# EAGLE board FullBoard (EAGLE 9.3.2)
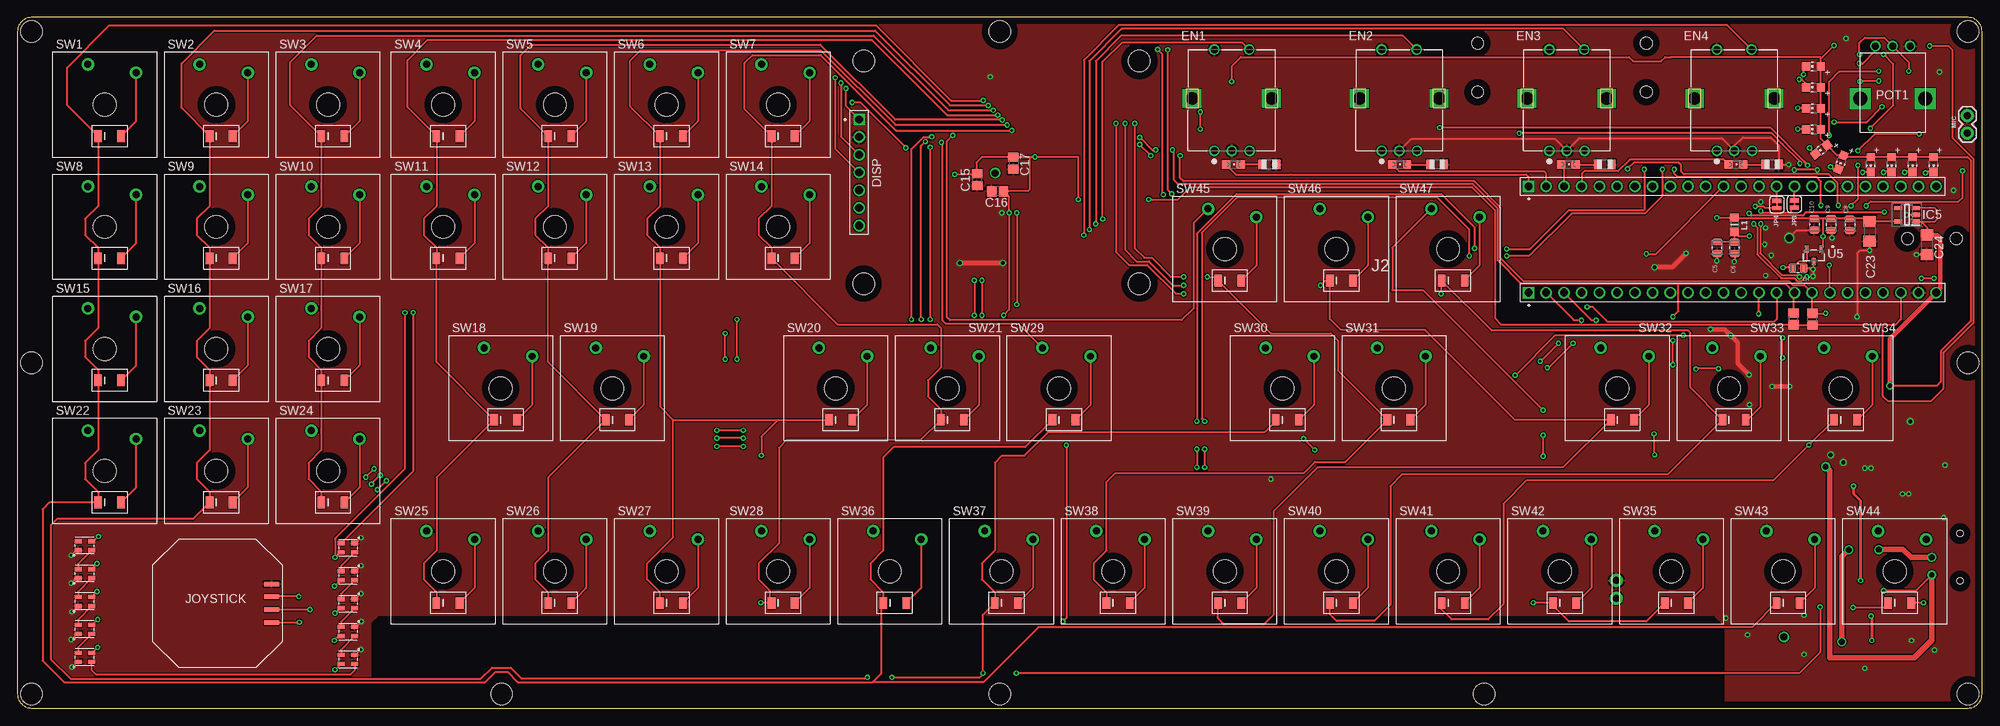
[diagram p3: board, top side]
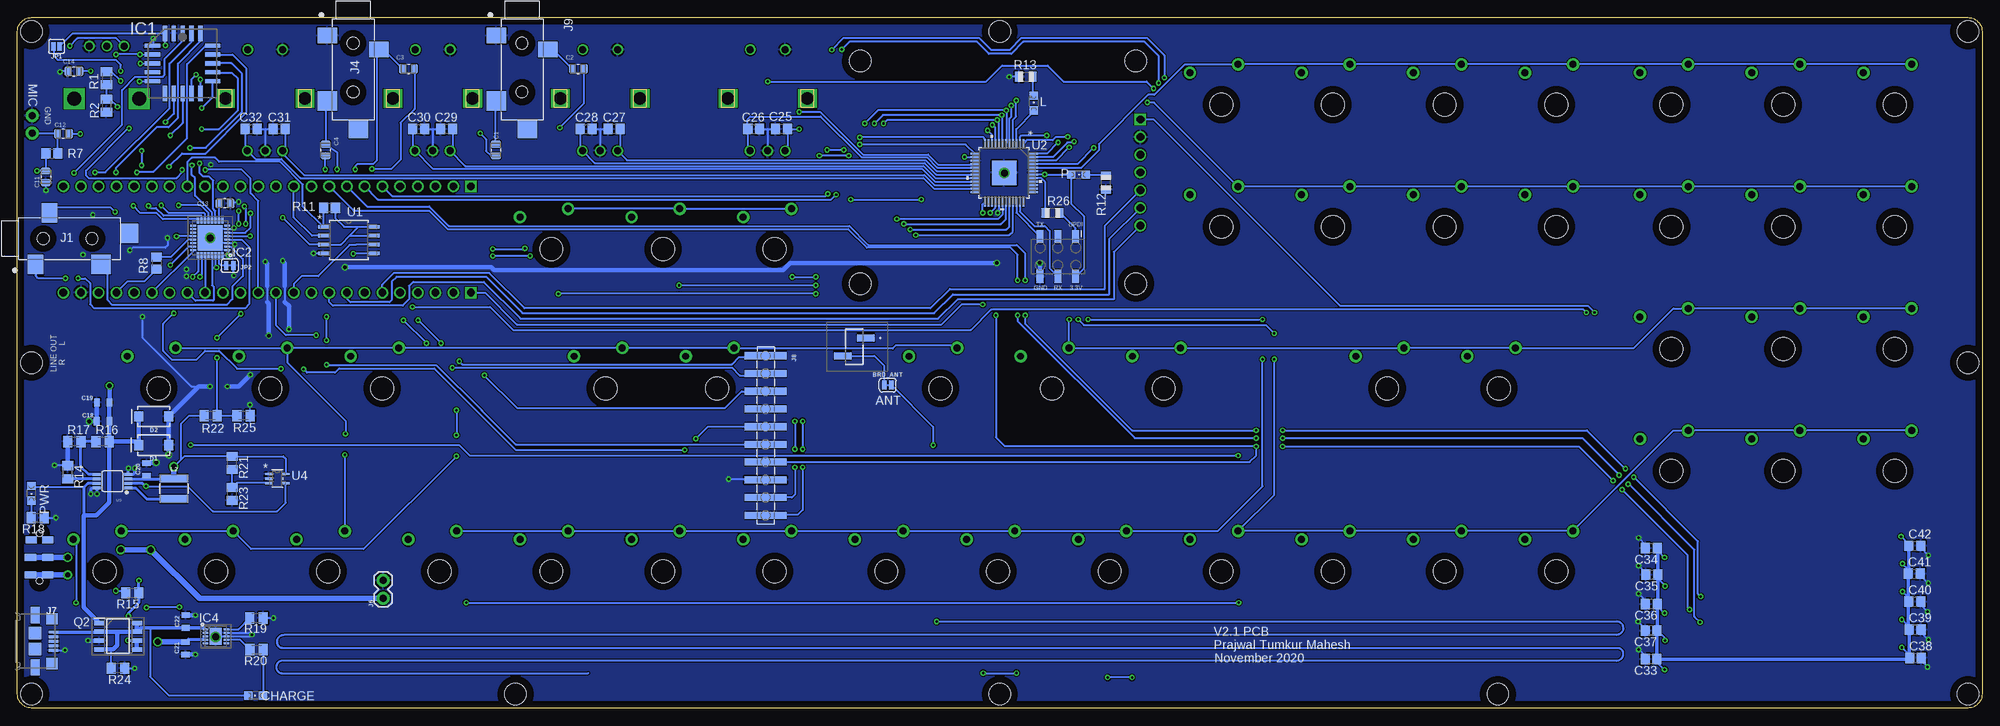
[diagram p4: board, bottom side, seen from below]

Size 281.5 x 99 mm. Coordinates in mm from the lower left corner, seen from the top.
Outline: 0,97 0,2 arc90 2,0 279.5,0 arc90 281.5,2 281.5,97 arc90 279.5,99 2,99 arc90 0,97
Copper layers (1*16): Top 0.035mm / dielectric 1.5mm / Bottom 0.035mm
Design rules "default": minimum track width 6mil, minimum drill 0.35mm, track to track 6mil, track to pad 6mil, pad to pad 6mil, via to via 6mil, smd to smd 6mil, copper to edge 40mil, drill to drill 6mil, minimum pad ring 10mil, minimum via ring 8mil, stop-mask expansion 4mil, vias tented up to drill 0mil, thermal gap 10mil
Holes 3.1 mm at 121.25,92.74 160.75,92.74 160.75,60.83 121.25,60.83 2,97 2,2 279.5,2 279.5,97 140.75,2 140.75,97 2,49.5 279.5,49.5 210.12,2 69.38,2

## Footprints (pad centres in the part's own frame; a part is rotated, then mirrored left to right if it is on the bottom)
M208770246R = smd 1 x 2.51: 1 -1.27,1.655; 2 1.27,-1.655
SMT-JUMPER_2_NC_TRACE_SILK = smd 0.635 x 1.27: 1 -0.508,0; 2 0.508,0
CAP_0805 = smd 1.05 x 1.38: 1 -0.84,0; 2 0.84,0
C0805 = smd 1.3 x 1.5: 1 -0.85,0; 2 0.85,0
0805 = smd 0.8 x 1.2: 1 -0.9,0; 2 0.9,0
C1206 = smd 1.6 x 1.8: 1 -1.4,0; 2 1.4,0
CHIPLED_0805 = smd 1.2 x 1.2: A 0,-1.05; C 0,1.05
SMA-DIODE = smd 1.27 x 1.47: A -2.15,0; C 2.15,0
61300711121 = drill 1.1 square: 1 -7.62,0 | drill 1.1: 2 -5.08,0; 3 -2.54,0; 4 0,0; 5 2.54,0; 6 5.08,0; 7 7.62,0
PEC11R-4215K-S0024 = drill 1: 1 -2.5,7; 2 2.5,7; A -2.5,-7.5; B 2.55,-7.5; C 0,-7.5 | drill 1.8 square: M1 -5.7,0; M2 5.7,0
PLCC20S = smd 0.6 x 2.2: 1 0,4.3; 2 -1.27,4.3; 3 -2.54,4.3; 9 -2.54,-4.3; 10 -1.27,-4.3; 11 0,-4.3; 12 1.27,-4.3; 13 2.54,-4.3; 19 2.54,4.3; 20 1.27,4.3 | smd 2.2 x 0.6: 4 -4.3,2.54; 5 -4.3,1.27; 6 -4.3,0; 7 -4.3,-1.27; 8 -4.3,-2.54; 14 4.3,-2.54; 15 4.3,-1.27; 16 4.3,0; 17 4.3,1.27; 18 4.3,2.54
QFN50P500X500X90-33N = smd 0.85 x 0.3: 1 -2.45,1.75; 2 -2.45,1.25; 3 -2.45,0.75; 4 -2.45,0.25; 5 -2.45,-0.25; 6 -2.45,-0.75; 7 -2.45,-1.25; 8 -2.45,-1.75; 17 2.45,-1.75; 18 2.45,-1.25; 19 2.45,-0.75; 20 2.45,-0.25; 21 2.45,0.25; 22 2.45,0.75; 23 2.45,1.25; 24 2.45,1.75 | smd 0.3 x 0.85: 9 -1.75,-2.45; 10 -1.25,-2.45; 11 -0.75,-2.45; 12 -0.25,-2.45; 13 0.25,-2.45; 14 0.75,-2.45; 15 1.25,-2.45; 16 1.75,-2.45; 25 1.75,2.45; 26 1.25,2.45; 27 0.75,2.45; 28 0.25,2.45; 29 -0.25,2.45; 30 -0.75,2.45; 31 -1.25,2.45; 32 -1.75,2.45 | smd 3.6 x 3.6: 33 0,0
SON50P300X300X100-11N = smd 0.8 x 0.3: 1 -1.5,1; 2 -1.5,0.5; 3 -1.5,0; 4 -1.5,-0.5; 5 -1.5,-1; 6 1.5,-1; 7 1.5,-0.5; 8 1.5,0; 9 1.5,0.5; 10 1.5,1 | smd 1.75 x 2.45: 11 0,0
SOT95P280X145-5N = smd 1.15 x 0.6: 1 -1.25,0.95; 2 -1.25,0; 3 -1.25,-0.95; 4 1.25,-0.95; 5 1.25,0.95
SJ-3524-SMT-TR = smd 2.2 x 2.8: 1 -3.6,-3.7; 3 -1.6,3.7 | smd 2.8 x 2.8: 2 5.8,-3.7 | smd 2.6 x 2.8: 4 9.8,0.75 | hole 1.7: -2.5,0; 4.5,0
61302411121 = drill 1.1 square: 1 -29.21,0 | drill 1.1: 2 -26.67,0; 3 -24.13,0; 4 -21.59,0; 5 -19.05,0; 6 -16.51,0; 7 -13.97,0; 8 -11.43,0; 9 -8.89,0; 10 -6.35,0; 11 -3.81,0; 12 -1.27,0; 13 1.27,0; 14 3.81,0; 15 6.35,0; 16 8.89,0; 17 11.43,0; 18 13.97,0; 19 16.51,0; 20 19.05,0; 21 21.59,0; 22 24.13,0; 23 26.67,0; 24 29.21,0
2X3_SMD = smd 1.02 x 1.9: 1 -2.54,-2.85; 2 -2.54,2.85; 3 0,-2.85; 4 0,2.85; 5 2.54,-2.85; 6 2.54,2.85
1X02 = drill 1.016 pad 1.88: 1 0,0; 2 2.54,0
1981584-1 = smd 0.4 x 1.35: 1 -1.3,4.1; 2 -0.65,4.1; 3 0,4.1; 4 0.65,4.1; 5 1.3,4.1 | smd 1.8 x 1.8: M1 -1.15,1.45; M2 1.15,1.45 | smd 2.3 x 1.3: S1 -3.75,1.45; S2 3.75,1.45 | smd 1.6 x 1.6: S3 -3.2,3.885; S4 3.2,3.885
1X10_SMD_MALE = smd 1.02 x 6: 1 0,0; 2 2.54,0; 3 5.08,0; 4 7.62,0; 5 10.16,0; 6 12.7,0; 7 15.24,0; 8 17.78,0; 9 20.32,0; 10 22.86,0
SMT-JUMPER_2_NO_SILK = smd 0.635 x 1.27: 1 -0.406,0; 2 0.406,0
RC-MASTER-SMD_L0805MP = smd 1.2 x 1.3: 1 -1.016,0; 2 1.016,0
INDUCTOR_4X4MM = smd 4.089 x 1.143: P$1 0,1.473; P$2 0,-1.473
CHIP-LED0805 = smd 1.2 x 1.2: A 0,-1.05; C 0,1.05
PO915N_POT = drill 1: ADJ 0,-7.5; V1 -2.5,-7.5; V2 2.5,-7.5 | drill 2 square: P$4 -4.65,0; P$5 4.65,0
SOIC127P600X175-8N = smd 1.5 x 0.65: 1 -2.7,1.905; 2 -2.7,0.635; 3 -2.7,-0.635; 4 -2.7,-1.905; 5 2.7,-1.905; 6 2.7,-0.635; 7 2.7,0.635; 8 2.7,1.905
M0805 = smd 1.3 x 1.6: 1 -0.95,0; 2 0.95,0
R0805 = smd 1.1 x 1.4: 1 -1,0; 2 1,0
R0805' = smd 1.3 x 1.5: 1 -0.85,0; 2 0.85,0
GATERON_LP_PLAIN = drill 1 pad 1.778: 1 -2.4,5.8; SW2 4.5,4.6 | smd 1.1 x 1.65: 2 -0.95,-4.5; A 2.35,-4.5 | hole 3.3: 0,0
WIN_S-8_WIN = smd 1.499 x 0.533: 1 -3.658,1.905; 2 -3.658,0.635; 3 -3.658,-0.635; 4 -3.658,-1.905; 5 3.658,-1.905; 6 3.658,-0.635; 7 3.658,0.635; 8 3.658,1.905
TQFP48_7X7MC_MCH = smd 1.341 x 0.279: 1 -4.176,2.75; 2 -4.176,2.25; 3 -4.176,1.75; 4 -4.176,1.25; 5 -4.176,0.75; 6 -4.176,0.25; 7 -4.176,-0.25; 8 -4.176,-0.75; 9 -4.176,-1.25; 10 -4.176,-1.75; 11 -4.176,-2.25; 12 -4.176,-2.75; 25 4.176,-2.75; 26 4.176,-2.25; 27 4.176,-1.75; 28 4.176,-1.25; 29 4.176,-0.75; 30 4.176,-0.25; 31 4.176,0.25; 32 4.176,0.75; 33 4.176,1.25; 34 4.176,1.75; 35 4.176,2.25; 36 4.176,2.75 | smd 0.279 x 1.341: 13 -2.75,-4.176; 14 -2.25,-4.176; 15 -1.75,-4.176; 16 -1.25,-4.176; 17 -0.75,-4.176; 18 -0.25,-4.176; 19 0.25,-4.176; 20 0.75,-4.176; 21 1.25,-4.176; 22 1.75,-4.176; 23 2.25,-4.176; 24 2.75,-4.176; 37 2.75,4.176; 38 2.25,4.176; 39 1.75,4.176; 40 1.25,4.176; 41 0.75,4.176; 42 0.25,4.176; 43 -0.25,4.176; 44 -0.75,4.176; 45 -1.25,4.176; 46 -1.75,4.176; 47 -2.25,4.176; 48 -2.75,4.176 | smd 3.505 x 3.505: EPAD 0,0
MSOP8 = smd 0.4 x 1.1: 1 -0.975,-2.25; 2 -0.325,-2.25; 3 0.325,-2.25; 4 0.975,-2.25; 5 0.975,2.25; 6 0.325,2.25; 7 -0.325,2.25; 8 -0.975,2.25
21-0076E_MXM-M = smd 1.079 x 0.305: 1 -1.213,0.65; 2 -1.213,0; 3 -1.213,-0.65; 4 1.213,-0.65; 5 1.213,0.65
SOT-23_DIO-L = smd 0.53 x 1.01: 1 -1.025,-0.895; 2 1.025,-0.895; 3 0,0.895
JS202011JAQN = smd 1 x 1.6: P$1 0,0; P$2 2.5,0; P$3 5,0; P$4 0,-2.4; P$5 2.5,-2.5; P$6 5,-2.5 | hole 0.9: -0.9,-1.2; 5.9,-1.2
PSP_JOYSTICK = smd 2.159 x 0.635: GND 7.75,2.75; POWER 7.75,-0.917; X 7.75,-2.75; Y 7.75,0.917
SK6805-2427 = smd 1 x 0.6: DIN 0.375,1.85; DOUT 2.325,0.55; GND 2.325,1.85; VCC 0.375,0.55

## Placement (x,y rotation side)
ANT  M20-8770246R  [M208770246R]  161.6,51.77 270 bottom
BRD_ANT  JUMPER-SMT_2_NC_TRACE_SILK  [SMT-JUMPER_2_NC_TRACE_SILK]  156.8,46.3 0 bottom
C1  2.2uF  [CAP_0805]  212.95,80 270 bottom
C2  2.2uF  [CAP_0805]  201.16,91.65 0 bottom
C3  2.2uF  [CAP_0805]  225.46,91.65 0 bottom
C4  2.2uF  [CAP_0805]  237.35,80 270 bottom
C5  0.1uF  [CAP_0805]  243.55,66 90 top
C6  2.2uF  [CAP_0805]  246.05,65.98 90 top
C7  2.2uF  [CAP_0805]  255.14,63.05 180 top
C8  0.1uF  [CAP_0805]  262.57,69.3 270 top
C9  0.1uF  [CAP_0805]  259.87,69.32 270 top
C10  2.2uF  [CAP_0805]  257.47,69.34 270 top
C11  2,2uF  [CAP_0805]  277.43,76.16 270 bottom
C12  0.1uF  [CAP_0805]  274.92,82.33 180 bottom
C13  0.15uF  [CAP_0805]  251.8,72.33 180 bottom
C14  0.1uF  [CAP_0805]  273.42,91.27 0 bottom
C15  100nF  [C0805]  137.51,75.77 270 top
C16  100nF  [C0805]  140.45,74.09 180 top
C17  100nF  [C0805]  142.71,78.13 270 top
C18  22uF  [0805]  269.24,41.11 180 bottom
C19  22uF  [0805]  269.23,43.81 180 bottom
C20  22uF  [0805]  262.99,34.22 90 bottom
C21  22uF  [0805]  257.41,8.59 270 bottom
C22  22uF  [0805]  257.39,12.4 90 bottom
C23  1uF  [C1206]  265.39,68.35 270 top
C24  1uF  [C1206]  273.59,66.43 270 top
C25  100nF  [C0805]  172,83 180 bottom
C26  100nF  [C0805]  176,83 0 bottom
C27  100nF  [C0805]  196,83 180 bottom
C28  100nF  [C0805]  200,83 0 bottom
C29  100nF  [C0805]  220,83 180 bottom
C30  100nF  [C0805]  224,83 0 bottom
C31  100nF  [C0805]  244,83 180 bottom
C32  100nF  [C0805]  248,83 0 bottom
C33  .1uF  [C0805]  47.42,7 180 bottom
C34  .1uF  [C0805]  47.37,22.9 180 bottom
C35  .1uF  [C0805]  47.32,19.1 180 bottom
C36  .1uF  [C0805]  47.37,14.9 180 bottom
C37  .1uF  [C0805]  47.42,11.1 180 bottom
C38  .1uF  [C0805]  9.53,7.2 0 bottom
C39  .1uF  [C0805]  9.6,11.25 0 bottom
C40  .1uF  [C0805]  9.65,15.25 0 bottom
C41  .1uF  [C0805]  9.7,19.25 0 bottom
C42  .1uF  [C0805]  9.65,23.25 0 bottom
CHARGE  [CHIPLED_0805]  247.36,1.81 90 bottom
D1  3A/40V/500mV  [SMA-DIODE]  261.99,37.69 180 bottom
D2  3A/40V/500mV  [SMA-DIODE]  261.97,41.79 180 bottom
DISP  61300711121  [61300711121]  120.6,76.78 270 top
EN1  PEC11R-4215K-S0024  [PEC11R-4215K-S0024]  174,87.38 0 top
EN2  PEC11R-4215K-S0024  [PEC11R-4215K-S0024]  198,87.38 0 top
EN3  PEC11R-4215K-S0024  [PEC11R-4215K-S0024]  222,87.38 0 top
EN4  PEC11R-4215K-S0024  [PEC11R-4215K-S0024]  246,87.38 0 top
IC1  LM3914V  [PLCC20S]  257.83,92.41 0 bottom
IC2  SGTL5000XNAA3  [QFN50P500X500X90-33N]  253.88,67.4 180 bottom
IC4  MCP73113-16SI_MF  [SON50P300X300X100-11N]  253.08,10.29 0 bottom
IC5  NCP163ASN330T1G  [SOT95P280X145-5N]  270.73,70.71 180 top
J1  SJ-3524-SMT-TR  [SJ-3524-SMT-TR]  275.3,67.3 0 bottom
J2  Teensy2  [61302411121]  245.73,59.55 0 top
J3  Teensy1  [61302411121]  245.73,74.79 0 top
J4  SJ-3524-SMT-TR  [SJ-3524-SMT-TR]  233.4,92.8 270 bottom
J5  [2X3_SMD]  132.42,64.73 180 bottom
J6  [1X02]  229.09,15.75 90 bottom
J7  1981584-1  [1981584-1]  280.43,9.58 270 bottom
J8  [1X10_SMD_MALE]  174.3,50.5 270 bottom
J9  SJ-3524-SMT-TR  [SJ-3524-SMT-TR]  209.2,92.8 270 bottom
JP1  JUMPER-SMT_2_NO_SILK  [SMT-JUMPER_2_NO_SILK]  275.9,94.83 180 bottom
JP2  JUMPER-SMT_2_NC_TRACE_SILK  [SMT-JUMPER_2_NC_TRACE_SILK]  251.08,63.41 180 bottom
JP3  JUMPER-SMT_2_NC_TRACE_SILK  [SMT-JUMPER_2_NC_TRACE_SILK]  254.59,72.25 270 top
JP4  JUMPER-SMT_2_NC_TRACE_SILK  [SMT-JUMPER_2_NC_TRACE_SILK]  252.09,72.18 270 top
L  [CHIPLED_0805]  135.88,86.74 0 bottom
L1  [RC-MASTER-SMD_L0805MP]  246.01,69.3 270 top
L2  2.2UH3A  [INDUCTOR_4X4MM]  259.08,31.46 0 bottom
LED1  [CHIP-LED0805]  274.56,77.92 180 top
LED2  [CHIP-LED0805]  271.56,77.92 180 top
LED3  [CHIP-LED0805]  268.56,77.92 180 top
LED4  [CHIP-LED0805]  265.56,77.92 180 top
LED5  [CHIP-LED0805]  261.29,78.23 159.7 top
LED6  [CHIP-LED0805]  258.46,80.05 127.4 top
LED7  [CHIP-LED0805]  257.34,82.97 90 top
LED8  [CHIP-LED0805]  257.34,85.97 90 top
LED9  [CHIP-LED0805]  257.34,88.97 90 top
LED10  [CHIP-LED0805]  257.34,91.97 90 top
LED11  [CHIPLED_0805]  174.23,77.92 270 top
LED12  [CHIPLED_0805]  198.03,77.92 270 top
LED13  [CHIPLED_0805]  222.23,77.92 270 top
LED14  [CHIPLED_0805]  246.23,77.92 270 top
MIC  [1X02]  279.4,82.4 90 top
P  [CHIPLED_0805]  129.46,76.46 270 bottom
POT1  P0915N_POT  [PO915N_POT]  268.71,87.38 180 top
PWR  [CHIPLED_0805]  279.5,30.8 180 bottom
Q2  DMG9926USD-13  [SOIC127P600X175-8N]  267.08,10.31 0 bottom
R1  2.2K  [M0805]  268.75,90.3 90 bottom
R2  3.3K  [M0805]  268.75,86.35 90 bottom
R3  220  [R0805]  179.4,77.92 180 top
R4  220  [R0805]  203.42,77.92 180 top
R5  220  [R0805]  227.44,77.92 180 top
R6  220  [R0805]  251.4,77.92 180 top
R7  2.2k  [R0805']  276.56,79.5 0 bottom
R8  100  [R0805']  261.55,63.8 270 bottom
R9  2.2k  [R0805']  254.5,55.79 90 top
R10  2.2k  [R0805']  257.2,55.74 90 top
R11  10k  [R0805']  236.79,71.7 180 bottom
R12  10k  [R0805]  125.52,75.32 90 bottom
R13  10k  [R0805]  137,90.52 0 bottom
R14  DNP  [M0805]  274.31,33.8 270 bottom
R15  750K  [M0805]  265.05,16.51 180 bottom
R16  750K  [M0805]  269.3,38.19 0 bottom
R17  100K  [M0805]  273.35,38.19 0 bottom
R18  4.7K  [M0805]  278.59,27.29 180 bottom
R19  1.15K  [M0805]  247.25,12.91 180 bottom
R20  440  [M0805]  247.24,8.39 180 bottom
R21  3.2M  [M0805]  250.71,35.15 270 bottom
R22  4K  [M0805]  253.8,41.9 0 bottom
R23  1.82M  [M0805]  250.71,30.7 270 bottom
R24  100K  [M0805]  267.1,5.69 0 bottom
R25  10K  [M0805]  249.1,41.9 0 bottom
R26  4.7K  [R0805]  133.2,71 0 bottom
SW1  GATERON_LOW_PROFILE  [GATERON_LP_PLAIN]  12.5,86.48 0 top
SW2  GATERON_LOW_PROFILE  [GATERON_LP_PLAIN]  28.5,86.48 0 top
SW3  GATERON_LOW_PROFILE  [GATERON_LP_PLAIN]  44.5,86.48 0 top
SW4  GATERON_LOW_PROFILE  [GATERON_LP_PLAIN]  61,86.48 0 top
SW5  GATERON_LOW_PROFILE  [GATERON_LP_PLAIN]  77,86.48 0 top
SW6  GATERON_LOW_PROFILE  [GATERON_LP_PLAIN]  93,86.48 0 top
SW7  GATERON_LOW_PROFILE  [GATERON_LP_PLAIN]  109,86.48 0 top
SW8  GATERON_LOW_PROFILE  [GATERON_LP_PLAIN]  12.5,68.98 0 top
SW9  GATERON_LOW_PROFILE  [GATERON_LP_PLAIN]  28.5,68.98 0 top
SW10  GATERON_LOW_PROFILE  [GATERON_LP_PLAIN]  44.5,68.98 0 top
SW11  GATERON_LOW_PROFILE  [GATERON_LP_PLAIN]  61,68.98 0 top
SW12  GATERON_LOW_PROFILE  [GATERON_LP_PLAIN]  77,68.98 0 top
SW13  GATERON_LOW_PROFILE  [GATERON_LP_PLAIN]  93,68.98 0 top
SW14  GATERON_LOW_PROFILE  [GATERON_LP_PLAIN]  109,68.98 0 top
SW15  GATERON_LOW_PROFILE  [GATERON_LP_PLAIN]  12.5,51.48 0 top
SW16  GATERON_LOW_PROFILE  [GATERON_LP_PLAIN]  28.5,51.48 0 top
SW17  GATERON_LOW_PROFILE  [GATERON_LP_PLAIN]  44.5,51.48 0 top
SW18  GATERON_LOW_PROFILE  [GATERON_LP_PLAIN]  69.25,45.83 0 top
SW19  GATERON_LOW_PROFILE  [GATERON_LP_PLAIN]  85.25,45.83 0 top
SW20  GATERON_LOW_PROFILE  [GATERON_LP_PLAIN]  117.25,45.83 0 top
SW21  GATERON_LOW_PROFILE  [GATERON_LP_PLAIN]  133.25,45.83 0 top
SW22  GATERON_LOW_PROFILE  [GATERON_LP_PLAIN]  12.5,33.98 0 top
SW23  GATERON_LOW_PROFILE  [GATERON_LP_PLAIN]  28.5,33.98 0 top
SW24  GATERON_LOW_PROFILE  [GATERON_LP_PLAIN]  44.5,33.98 0 top
SW25  GATERON_LOW_PROFILE  [GATERON_LP_PLAIN]  61,19.58 0 top
SW26  GATERON_LOW_PROFILE  [GATERON_LP_PLAIN]  77,19.58 0 top
SW27  GATERON_LOW_PROFILE  [GATERON_LP_PLAIN]  93,19.58 0 top
SW28  GATERON_LOW_PROFILE  [GATERON_LP_PLAIN]  109,19.58 0 top
SW29  GATERON_LOW_PROFILE  [GATERON_LP_PLAIN]  149.25,45.83 0 top
SW30  GATERON_LOW_PROFILE  [GATERON_LP_PLAIN]  181.25,45.83 0 top
SW31  GATERON_LOW_PROFILE  [GATERON_LP_PLAIN]  197.25,45.83 0 top
SW32  GATERON_LOW_PROFILE  [GATERON_LP_PLAIN]  229.25,45.83 0 top
SW33  GATERON_LOW_PROFILE  [GATERON_LP_PLAIN]  245.25,45.83 0 top
SW34  GATERON_LOW_PROFILE  [GATERON_LP_PLAIN]  261.25,45.83 0 top
SW35  GATERON_LOW_PROFILE  [GATERON_LP_PLAIN]  237,19.58 0 top
SW36  GATERON_LOW_PROFILE  [GATERON_LP_PLAIN]  125,19.58 0 top
SW37  GATERON_LOW_PROFILE  [GATERON_LP_PLAIN]  141,19.58 0 top
SW38  GATERON_LOW_PROFILE  [GATERON_LP_PLAIN]  157,19.58 0 top
SW39  GATERON_LOW_PROFILE  [GATERON_LP_PLAIN]  173,19.58 0 top
SW40  GATERON_LOW_PROFILE  [GATERON_LP_PLAIN]  189,19.58 0 top
SW41  GATERON_LOW_PROFILE  [GATERON_LP_PLAIN]  205,19.58 0 top
SW42  GATERON_LOW_PROFILE  [GATERON_LP_PLAIN]  221,19.58 0 top
SW43  GATERON_LOW_PROFILE  [GATERON_LP_PLAIN]  253,19.58 0 top
SW44  GATERON_LOW_PROFILE  [GATERON_LP_PLAIN]  269,19.58 0 top
SW45  GATERON_LOW_PROFILE  [GATERON_LP_PLAIN]  173,65.78 0 top
SW46  GATERON_LOW_PROFILE  [GATERON_LP_PLAIN]  189,65.78 0 top
SW47  GATERON_LOW_PROFILE  [GATERON_LP_PLAIN]  205,65.78 0 top
U1  W25Q128FVSIG  [WIN_S-8_WIN]  234.03,67.09 0 bottom
U2  ATMEGA4809-AFR  [TQFP48_7X7MC_MCH]  140.13,76.73 270 bottom
U3  PAM2401  [MSOP8]  267.89,32.52 90 bottom
U4  MAX6775XKA+21-0076E_MXM-M  [21-0076E_MXM-M]  244.27,32.89 0 bottom
U5  AP7313-15SAG-7SOT-23_DIO-L  [SOT-23_DIO-L]  257.4,64.9 180 top
U$1  JS202011JAQN  [JS202011JAQN]  277.14,24.12 270 bottom
U$2  PSP_JOYSTICK  [PSP_JOYSTICK]  28.67,15.03 0 top
U$25  NEOPIXEL_NANO_2427  [SK6805-2427]  46,21.78 0 top
U$26  NEOPIXEL_NANO_2427  [SK6805-2427]  46,17.78 0 top
U$27  NEOPIXEL_NANO_2427  [SK6805-2427]  46,13.78 0 top
U$36  NEOPIXEL_NANO_2427  [SK6805-2427]  46,9.78 0 top
U$41  NEOPIXEL_NANO_2427  [SK6805-2427]  46,5.78 0 top
U$42  NEOPIXEL_NANO_2427  [SK6805-2427]  11,8.48 180 top
U$43  NEOPIXEL_NANO_2427  [SK6805-2427]  11,12.48 180 top
U$44  NEOPIXEL_NANO_2427  [SK6805-2427]  11,16.48 180 top
U$45  NEOPIXEL_NANO_2427  [SK6805-2427]  11,20.48 180 top
U$46  NEOPIXEL_NANO_2427  [SK6805-2427]  11,24.48 180 top

## Tracks (layer width: path | path; a pad name or v marks a point on that pad's centre or on a via)
!RADIO_RST  (via drill 0.35)
  Top 0.254: v214.6,47.7 220.34,53.44 v238.7,53.44
  Bottom 0.254: v214.6,47.7 209.94,43.04 180.09,43.04 178.57,44.57 177.73,45.4 174.32,45.4 J8.3 | v238.7,53.44 243.04,53.44 244.46,54.86 J2.12
+5V  (via drill 0.35, 0.65)
  Top 0.254: 258.39,93.09 v260.3,95 | U$43.VCC 10.73,11.93 v11.5,12.7 | v11.4,16.7 v11.39,16.7 U$44.VCC | v11.4,20.7 v11.39,20.7 U$45.VCC | v11.6,24.6 10.93,23.93 U$46.VCC | U$25.VCC 46.23,22.33 v45.5,21.6 45.5,24.3 55.5,34.3 v55.5,56.7 | U$26.VCC 45.54,17.5 v45.4,17.5 | U$27.VCC 46.23,14.33 v45.5,13.6 | U$36.VCC 46.03,10.33 v45.4,9.7 | U$41.VCC 45.54,5.5 v45.5,5.5 | IC5.3 274.74,71.66 275.1,71.3 275.1,70.1 274.7,69.7 272.8,69.7 | DISP.1 118.72,86.29 v118.72,88.81 | v174,89.8 174,92 175.3,93.3 230.9,93.3 231.5,92.7 235.5,92.7 236.1,93.3 236.9,93.3 236.91,93.29 258.39,93.29 258.39,93.09 | 258.39,93.09 LED10.A LED9.A LED8.A LED7.A 258.39,81.6 LED6.A 260.77,79.22 LED5.A 261.89,78.97 LED4.A LED3.A LED2.A LED1.A 279.45,78.97 279.89,78.53 279.89,55.47 275.59,51.17 275.59,46.79 275,46.2 v268.3,46.2 | U$42.VCC arc45 10.81,8.01 v11.5,8.7 | IC5.1 272.04,69.7 272.8,69.7 | 272.8,69.7 273.62,68.88 273.62,67.8
  Top 0.61: v268.3,46.2 268.3,52.92 J2.24 275.54,60.15 275.54,67.36 275.1,67.8 273.62,67.8 C24.1
  Bottom 0.254: JP1.1 273.61,96.71 IC1.3 260.37,95.07 v260.3,95 | v11.5,8.7 10.38,7.58 C38.1 | v11.5,12.7 10.6,11.8 10.6,11.61 arc-45 C39.1 | v11.4,16.7 10.5,15.8 C40.1 10.7,15.25 | v11.4,20.7 10.55,19.85 C41.1 | v11.6,24.6 10.5,23.5 C42.1 | C34.1 46.52,22.62 v45.5,21.6 | C35.1 46.47,18.57 v45.4,17.5 | C36.1 46.52,14.62 v45.5,13.6 | v45.4,9.7 45.4,10 46.5,11.1 C37.1 | C33.1 46.57,6.57 v45.5,5.5 | v118.72,88.81 119.7,89.8 131.6,89.8 133.9,92.1 140.4,92.1 142.7,89.8 v174,89.8 | DISP.1 118.7,84.4 92,57.7 56.5,57.7 v55.5,56.7 | 272,31.6 279.25,31.6 PWR.A
  Bottom 0.406: U3.7 271.4,32.2 272,31.6 272,27.6
  Bottom 0.508: C42.1 10.5,19.3 C41.1 10.55,15.4 10.7,15.25 | C40.1 10.6,15.15 10.6,11.8 | C39.1 10.45,7.27 C38.1 10.58,7 C33.1 C37.1 | C34.1 46.47,22.85 C35.1 46.47,14.95 C36.1 46.52,11.12 46.5,11.1
  Bottom 0.61: Q2.1 272,14.44 272,27.6 270.2,27.6 268.35,29.45 R16.2 | R16.2 268.34,39.7 C18.1 C19.1 268.3,43.84 v268.3,46.2 | D2.C 264.12,37.71 | 264.12,37.71 D1.C | R16.2 264.6,38.19 264.12,37.71
  Bottom 0.813: C19.1
ADDR
  Bottom 0.254: IC2.31 252.63,63.73 252.3,63.4 252.29,63.41 JP2.2
BATT  (via drill 0.4, 0.7 pad 1.3, 0.8 pad 1.3)
  Top 0.254: v267.4,16.8 267.83,16.8 267.84,16.79 271.99,16.79 v274.3,19.1
  Top 0.813: v274.3,19.1 274.3,9.7 271.8,7.2 259.7,7.2 259.7,34 v259.1,34.6
  Bottom 0.254: v267.4,16.8 266.29,16.8 R15.2 | U4.5 243.06,35.76 243.4,36.1 R21.1 257.6,36.1 258.1,35.6 | 258.1,35.6 v259.1,34.6 | R22.1 256.95,41.9 258.1,40.75 258.1,35.6
  Bottom 0.406: 263.46,32.84 C20.1 262.51,32.84 | U3.3 263.46,32.84 | L2.P$1 259.17,32.84 262.51,32.84 | 263.46,32.84 262.51,32.84
  Bottom 0.813: U$1.P$6 U$1.P$3 274.32,19.12 v274.3,19.1 | v259.1,34.6 259.1,32.95 L2.P$1
BATT_DIVIDER  (via drill 0.35)
  Top 0.254: v252.9,50.2 v252.9,53.1 | v249.5,56.5 249.5,59.52 J2.14
  Bottom 0.254: R25.1 R22.2 252.85,50.15 v252.9,50.2 | v252.9,53.1 v249.5,56.5
CODEC_3.3V  (via drill 0.35)
  Top 0.254: IC5.5 C23.1 265,70.14 C8.1 262.55,70.16 C9.1 258.7,70.16 | 258.7,70.16 257.49,70.16 C10.1 246.15,70.18 L1.1 243.52,70.32 v243.5,70.3 | 258.7,70.16 v258.7,67.6 258.7,66.07 U5.1
  Bottom 0.254: v243.5,70.3 239.66,66.45 U1.3 235.15,66.45 233.88,67.72 | 233.88,67.72 U1.7 | 233.88,67.72 232.6,69 U1.8 234.69,69 235.94,70.24 R11.1 | IC2.20 258.65,67.65 v258.7,67.6
COL1  (via drill 0.35)
  Top 0.254: SW29.2 144.37,37.4 125.5,37.4 124.05,35.95 124.05,22.58 122.21,20.74 122.21,18.43 124.05,16.58 124.05,15.2 | 124.05,15.2 SW36.2 | 122.5,3.7 123.8,5 123.8,14.95 124.05,15.2 | 122.5,3.7 71.7,3.7 70.21,5.19 68.49,5.19 67,3.7 6.7,3.7 3.6,6.8 3.6,28.5 4.58,29.48 SW22.2 11.55,30.98 9.71,32.82 9.71,35.14 11.55,36.98 SW15.2 11.55,48.48 9.71,50.32 9.71,52.64 11.55,54.48 SW8.2 11.55,65.98 9.71,67.82 9.71,70.14 11.55,71.98 SW1.2 7.1,86.43 7.1,91.8 13.16,97.86 123.04,97.86 133.8,87.1 v138.4,87.1 | SW43.2 248.57,11.6 178.78,11.6 178.77,11.59 172.73,11.59 172.72,11.6 146.3,11.6 138.4,3.7 122.5,3.7
  Bottom 0.254: U2.4 138.88,84.32 138.4,84.8 v138.4,87.1
COL2  (via drill 0.35)
  Top 0.254: SW30.2 180.3,41.13 178.77,39.6 147.7,39.6 144.3,36.2 141.1,36.2 140.05,35.15 140.05,22.58 138.21,20.74 138.21,18.43 140.05,16.58 SW37.2 138.35,13.38 v138.35,5 138.35,4.85 137.9,4.4 v125.3,4.4 | v121.8,4.4 121.7,4.3 72.2,4.3 70.7,5.8 68,5.8 66.4,4.2 7.6,4.2 4.8,7 4.8,26.2 5.7,27.1 25.17,27.1 SW23.2 27.55,30.98 25.71,32.82 25.71,35.14 27.55,36.98 SW16.2 27.55,48.48 25.71,50.32 25.71,52.64 27.55,54.48 SW9.2 27.55,65.98 25.71,67.82 25.71,70.14 27.55,71.98 SW2.2 23.5,86.03 23.5,92.4 28.2,97.1 122.9,97.1 133.6,86.4 v139.1,86.4 | SW44.2 267.37,14.4 v263,14.4 | v258.3,14.5 258.3,8 255.3,5 v143.1,5
  Bottom 0.254: v121.8,4.4 v125.3,4.4 | U2.5 139.38,84.52 139.1,84.8 v139.1,86.4 | v263,14.4 262.9,14.5 v258.3,14.5 | v143.1,5 v138.35,5
COL3  (via drill 0.35)
  Top 0.254: SW24.2 43.55,30.98 41.71,32.82 41.71,35.14 43.55,36.98 SW17.2 43.55,48.48 41.71,50.32 41.71,52.64 43.55,54.48 SW10.2 43.55,65.98 41.71,67.82 41.71,70.14 43.55,71.98 SW3.2 39.1,86.43 39.1,92.6 42.9,96.4 122.7,96.4 133.4,85.7 v139.8,85.7 | SW38.2 156.05,16.58 154.21,18.43 154.21,20.74 156.05,22.58 156.05,32.4 157.35,33.7 184.3,33.7 185.9,35.3 190.27,35.3 SW31.2 196.27,41.33 189.2,48.4 189.2,52.7 188.2,53.7 179.63,53.7 SW45.2 171.53,61.8 v170.5,61.8 | v167.1,61.8 165.3,61.8 162.55,64.55 161.45,64.55 160.1,65.9 v160.1,83.8
  Bottom 0.254: U2.6 139.8,80.99 v139.8,85.7 158.2,85.7 v160.1,83.8 | v170.5,61.8 v167.1,61.8
COL4  (via drill 0.35)
  Top 0.254: SW25.2 60.05,16.58 58.21,18.43 58.21,20.74 60.05,22.58 60.05,33.08 SW18.2 60.05,49.58 SW11.2 60.05,65.98 58.21,67.82 58.21,70.14 60.05,71.98 SW4.2 55.9,86.13 55.9,92.9 58.8,95.8 122.4,95.8 133.2,85 v140.46,85 | SW39.2 172.05,12.85 172.9,12 178.6,12 180,13.4 180,28.2 186.3,34.5 221.47,34.5 SW32.2 214.57,41.33 201.7,54.2 189.6,54.2 188.05,55.75 SW46.2 187.38,61.28 v186.7,60.6 | v158.7,83.8 158.7,65.7 160.37,64.03 162.13,64.03 165.56,60.6 v167.1,60.6
  Bottom 0.254: U2.7 140.38,84.92 v140.46,85 157.5,85 v158.7,83.8 | v167.1,60.6 v186.7,60.6
COL5  (via drill 0.35)
  Top 0.254: SW26.2 76.05,16.58 74.21,18.43 74.21,20.74 76.05,22.58 76.05,33.08 SW19.2 76.05,49.58 SW12.2 76.05,65.98 74.21,67.82 74.21,70.14 76.05,71.98 SW5.2 72.1,85.93 72.1,93.6 73.59,95.09 115.03,95.09 125.78,84.34 141.06,84.34 v141.1,84.3 | SW40.2 188.05,13.45 189,12.5 194.4,12.5 196.7,14.8 196.7,31.8 198.4,33.5 236.47,33.5 SW33.2 239.7,45.93 239.7,53.8 239.4,54.1 211.23,54.1 SW47.2 204.02,61.32 204,61.3 v204,59.4 | v157.4,83.8 157.4,65.4 159.28,63.52 161.87,63.52 165.99,59.4 v167.1,59.4
  Bottom 0.254: U2.8 140.9,80.92 140.9,84.1 v141.1,84.3 156.9,84.3 v157.4,83.8 | v167.1,59.4 v204,59.4
COL6  (via drill 0.35)
  Top 0.254: 93.97,41.33 109,41.33 | 109,41.33 SW20.2 | 93.97,41.33 92.05,43.25 SW13.2 92.05,65.98 90.21,67.82 90.21,70.14 92.05,71.98 SW6.2 87.8,86.23 87.8,92.8 89.3,94.3 115.1,94.3 125.8,83.6 v141.8,83.6 | SW27.2 92.05,16.58 90.21,18.43 90.21,20.74 93.97,24.5 93.97,41.33 | SW34.2 v256.68,37.72 251.57,32.6 216.2,32.6 212.9,29.3 212.9,14.9 210.7,12.7 205.5,12.7 204.05,14.15 SW41.2 | 109,41.33 106.6,38.93 v106.6,36.2
  Bottom 0.254: U2.9 141.38,83.18 v141.8,83.6 | v256.68,37.72 256.67,37.7 218.2,37.7 216.7,36.2 v106.6,36.2
COL7  (via drill 0.35)
  Top 0.254: v142.5,82.8 125.9,82.8 115.1,93.6 105.3,93.6 104.2,92.5 104.2,85.83 SW7.2 108.05,71.98 106.21,70.14 106.21,67.82 108.05,65.98 SW14.2 117.53,55 131.8,55 132.3,54.5 132.3,48.83 130.46,46.99 130.46,44.67 132.3,42.83 SW21.2 129.37,38.4 110.2,38.4 109.1,37.3 109.1,23.63 106.21,20.74 106.21,18.43 107.77,16.87 107.77,15.37 SW28.2 106.52,15.08 v106.5,15.1 | SW35.2 233.37,12.4 222.3,12.4 220.05,14.65 SW42.2 217.22,15.08 v217.2,15.1
  Bottom 0.254: U2.10 141.88,82.18 v142.5,82.8 | v217.2,15.1 v106.5,15.1
CS1
  Bottom 0.254: DISP.5 125.7,69.14 125.7,60.1 147.9,60.1 150.67,57.33 208.85,57.33 213.9,62.38 213.9,62.4 227.52,62.4 229.22,60.7 J2.6
DC1
  Bottom 0.254: DISP.6 125.09,67.21 125.09,59.29 147.47,59.29 150.14,56.62 209.12,56.62 214.3,61.8 227.2,61.8 227.88,61.12 227.88,58.52 228.2,58.2 233.8,58.2 234.3,58.7 J2.8
EN  (via drill 0.35)
  Top 0.406: v265.6,13.2 265.7,13.1 v265.7,9.7 | v264.1,18.3 264.1,29.7 263.1,30.7 v263.1,31.8
  Bottom 0.254: v263.1,31.8 257.1,31.8 253.5,28.2 244.3,28.2 243.06,29.44 U4.4
  Bottom 0.406: Q2.6 265.68,9.68 v265.7,9.7 | v265.6,13.2 265.6,13.6 264.1,15.1 R15.1 v264.1,18.3 | v263.1,31.8 263.17,31.8 263.57,32.2 U3.2
  Bottom 0.61: Q2.6 Q2.5
ENC1_A  (via drill 0.35)
  Top 0.254: v169.5,83 v169.5,85.46
  Bottom 0.254: EN1.A 171.15,80.23 C25.1 v169.5,83 | v169.5,85.46 166.48,85.46 160.37,79.34 151.02,79.34 149.56,77.89 145.1,77.89 145.09,77.9 144.39,77.9 U2.16
ENC1_B
  Bottom 0.254: EN1.B 176.85,80.18 C26.1 176.85,84.45 176.5,84.8 166.4,84.8 160.54,78.94 151.19,78.94 149.73,77.48 U2.17
ENC1_LED
  Top 0.254: LED11.A 174.6,76.5 182.4,76.5 182.41,76.49 216.2,76.49 216.52,76.18 J3.1
ENC1_SEL  (via drill 0.35)
  Top 0.254: EN1.2 175.44,95.44 158.3,95.44 155.5,92.64 v155.5,70.1
  Bottom 0.254: U2.30 140.38,70.72 141,70.1 v155.5,70.1
ENC2_A
  Bottom 0.254: C27.1 195.15,80.23 EN2.A 194.15,78.53 151.36,78.53 149.81,76.98 U2.18
ENC2_B
  Bottom 0.254: C28.1 200.85,80.18 EN2.B 198.79,78.13 151.53,78.13 149.88,76.48 U2.19
ENC2_LED
  Top 0.254: LED12.A 198,76.9 218.8,76.9 219.06,76.64 J3.2
ENC2_SEL  (via drill 0.35)
  Top 0.254: EN2.2 198.54,96.34 158.1,96.34 154.51,92.76 154.51,69.41 v154.5,69.4
  Bottom 0.254: v154.5,69.4 140.6,69.4 139.88,70.12 U2.31
ENC3_A
  Bottom 0.254: C29.1 219.15,80.23 EN3.A 217.34,77.72 151.69,77.72 149.96,75.98 U2.20
ENC3_B
  Bottom 0.254: C30.1 224.85,80.18 EN3.B 221.98,77.31 151.86,77.31 150.03,75.48 U2.21
ENC3_LED
  Top 0.254: LED13.A 221.6,77.51 J3.3
ENC3_SEL  (via drill 0.35)
  Top 0.254: EN3.2 221.53,97.35 158.2,97.35 153.61,92.76 v153.61,68.61 v153.6,68.6
  Bottom 0.254: v153.6,68.6 139.8,68.6 139.38,69.02 U2.32
ENC4_A
  Bottom 0.254: C31.1 243.15,80.23 EN4.A 243.5,79.48 240.43,76.41 151.53,76.41 150.1,74.98 U2.22
ENC4_B
  Bottom 0.254: C32.1 248.85,80.18 EN4.B 247.38,78.71 243.69,78.71 240.99,76 151.7,76 150.18,74.48 U2.23
ENC4_LED
  Top 0.254: LED14.A 244.48,78.62 231.02,78.62 229.34,76.94 224.5,76.94 224.14,76.58 J3.4
ENC4_SEL  (via drill 0.35)
  Top 0.254: EN4.2 245.02,97.86 157.76,97.86 152.8,92.9 v152.8,67.8
  Bottom 0.254: v152.8,67.8 139.4,67.8 138.88,68.32 U2.33
GND  (via drill 0.35, 0.5, 0.6, 1 pad 1.3)
  Top 0.254: U$42.GND 8.53,6.63 v7.8,5.9 | U$43.GND 8.53,10.63 v7.7,9.8 | U$44.GND 7.84,13.8 v7.8,13.8 | U$45.GND 8.43,18.63 v7.7,17.9 | U$46.GND 8.43,22.63 v7.7,21.9 | U$25.GND 48.43,23.63 v49.2,24.4 | U$26.GND 48.43,19.63 v49.2,20.4 | U$27.GND 48.43,15.63 v49.2,16.4 | U$36.GND 48.53,11.63 v49.3,12.4 | C23.2 v265.4,65.6 264,65.6 263.6,65.2 v263.6,56.1 | C9.2 260,68.35 v260,67.4 | C7.1 257.15,63.05 v257.3,62.9 | U5.3 257.3,63.91 v257.3,62.9 | v257.3,62.9 v257.3,61.9 | C24.2 272.13,65.03 v272.1,65 | IC5.2 v270.7,70.7 | C5.1 243.55,64.15 v243.5,64.1 | C6.1 246.05,64.05 v246,64 | v270.1,30.7 v271,30.7 | IC2.33 254.98,68.5 C10.2 | v253.8,77.9 253.78,77.92 R6.1 252.4,80.6 251.2,81.8 247.2,81.8 246,80.6 EN4.C 244.18,81.7 223.82,81.7 EN3.C 222,79.9 220.3,81.6 199.72,81.6 EN2.C | 244.65,54.25 244.75,54.15 | v49.2,8.4 48.51,7.71 arc-45 U$41.GND
  Top 0.406: v264.7,34.4 v265.6,34.4
  Top 0.61: v242.6,54.28 242.63,54.25 244.65,54.25 | 244.75,54.15 v245.5,53.4 246.5,52.4 246.5,49.4 v248.1,47.8 | v251.4,46.1 v253.9,46.1 | v135,63.8 v141.2,63.8 | v234.6,63.2 237.1,63.2 v239.1,65.2
  Bottom 0.152: R25.2 248.15,43.45 v248.2,43.5
  Bottom 0.254: C32.2 246,83 | 246,83 C31.2 | 246,83 EN4.C | C30.2 222,83 | 222,83 C29.2 | 222,83 EN3.C | C28.2 198,83 | 198,83 C27.2 | 198,83 EN2.C | C26.2 174,83 | 174,83 C25.2 | 174,83 EN1.C | C38.2 8.68,6.78 v7.8,5.9 | C39.2 8.75,10.85 v7.7,9.8 | C40.2 8.8,14.8 v7.8,13.8 | C41.2 8.85,19.05 v7.7,17.9 | C42.2 8.8,23 v7.7,21.9 | v49.2,24.4 48.22,23.42 C34.2 | v49.2,20.4 48.17,19.37 C35.2 | v49.2,16.4 48.22,15.42 C36.2 | v49.3,12.4 48.27,11.37 C37.2 | v49.2,8.4 48.27,7.47 C33.2 | IC4.8 IC4.9 248.19,10.79 v247.9,10.5 248.11,10.29 IC4.8 | U2.29 140.86,72.53 140.86,71.18 v141.04,71 | C11.2 277.43,74.23 v277.4,74.2 | C14.1 275.33,91.27 v275.4,91.2 | IC1.4 262,94.95 v262,96 | JP2.1 250.57,62.07 v250.5,62 | U1.4 239.09,65.19 v239.1,65.2 | R14.1 276.16,34.76 v276.2,34.8 | R18.1 v276.01,27.29 v276,27.3 | IC2.1 251.3,65.52 v251.3,64.9 251.35,64.95 IC2.32 | v250.47,68.81 250.63,68.65 IC2.7 252.63,68.65 IC2.33 253.13,66.65 IC2.3 250.51,66.65 v250.36,66.49 | IC4.11 IC4.8 | R24.2 v264.71,5.69 v264.7,5.7 | 275.72,8.28 274.72,8.28 v274.7,8.3 | R19.1 v244.81,12.91 v244.8,12.9 | C13.1 250.73,72.56 v249.8,72.56 | 243.2,60.5 243.2,58.2 | 245.7,60.5 245.7,58.2 | v260,67.4 260,66.3 260.3,66 265,66 v265.4,65.6 | v263.6,56.1 263.6,53.1 256.6,46.1 v253.9,46.1 | R13.1 139.38,90.52 v139.4,90.5 | J8.8 arc-90 174.38,32.8 v179.6,32.8
  Bottom 0.406: v270.1,30.7 270.14,30.74 U3.8 270.19,31.5 270.9,31.5 271,31.4 v271,30.7 | v265.6,34.4 265.64,34.36 U3.4 264.9,33.49 264.7,33.7 v264.7,34.4
  Bottom 0.61: C19.2 C18.2 v271.19,41.11 v271.2,41.1 | R17.1 R14.1 | C22.2 v256,13.3 | C21.2 v256.01,7.69 v256,7.7 | Q2.3 271.38,9.68 v271.4,9.7 | v253.9,46.1 255.51,46.1 D2.A 259.82,37.71 D1.A 259.84,36.34 v259.8,36.3 | v251.4,46.1 249.8,46.1 v248.1,47.8 | v242.6,54.28 242.6,57.6 243.2,58.2 | v243.5,64.1 243.2,63.8 243.2,60.5 | J5.6 134.96,63.76 v135,63.8 | v141.2,63.8 170.78,63.8 171.77,62.81 191.09,62.81 191.1,62.8 213.2,62.8 213.6,63.2 v234.6,63.2 | v245.5,53.4 245.5,58 245.7,58.2 | v246,64 245.7,63.7 245.7,60.5 | C20.2 261.68,35.12 v261.6,35.2
  other vias: 253.88,67.4
  pour Top (rank 2): 0,99 0,0 281.5,0 281.5,99
  pour Bottom: 0,0 0,16.5 0,99 1.5,99 281.5,99 281.5,87 281.5,0 280.5,0
HPL  (via drill 0.35)
  Top 0.254: v248.1,70.9 248.41,70.59 255.79,70.59 256.2,71 267.4,71 v267.5,71.1
  Bottom 0.254: IC2.6 248.85,68.15 248.1,68.9 v248.1,70.9 | v267.5,71.1 268.2,71.8 276.1,71.8 J1.3
HPR
  Bottom 0.254: IC2.2 250.96,66.15 249.2,64.39 249.2,61.9 250.7,60.4 250.7,58.6 251.5,57.8 267.9,57.8 268.6,58.5 268.6,63.2 J1.2
HPVGND  (via drill 0.35)
  Top 0.254: v274.6,61.6 v272.8,61.6
  Bottom 0.254: IC2.4 249.35,67.15 248.3,66.1 248.3,57.9 248.9,57.3 270.5,57.3 271.1,57.9 271.1,60.9 271.8,61.6 v272.8,61.6 | J1.1 278.9,62 278.5,61.6 v274.6,61.6
JOYSTICK_X  (via drill 0.35)
  Top 0.254: v138.2,61.3 v138.2,56.3 | v104,38.7 v100.2,38.7 | v52,33.4 v50.7,32.1 | v40.4,12.3 40.38,12.28 U$2.X
  Bottom 0.254: J3.9 233.34,71.3 222.5,71.3 219.89,68.69 162.47,68.69 159.77,65.99 139.19,65.99 138.2,65 v138.2,61.3 | v138.2,56.3 138.2,55.5 121.4,38.7 v104,38.7 | v100.2,38.7 57.3,38.7 v52,33.4 | v50.7,32.1 50.6,32.1 41.2,22.7 41.2,13.1 v40.4,12.3
JOYSTICK_Y  (via drill 0.35)
  Top 0.254: v137.1,61.3 v137.1,56.3 | v104,39.8 v100.2,39.8 | v51.1,34.3 v49.9,33.1 | v40.3,16 36.47,16 U$2.Y
  Bottom 0.254: J3.8 231.4,71.89 222.5,71.89 219.71,69.1 162.3,69.1 159.6,66.4 138.3,66.4 137.1,65.2 v137.1,61.3 | v137.1,56.3 137.1,55.1 121.8,39.8 v104,39.8 | v100.2,39.8 56.6,39.8 v51.1,34.3 | v49.9,33.1 40.7,23.9 40.7,16.4 v40.3,16
LED_IND
  Bottom 0.254: U2.3 138.38,83.02 135.88,85.52 L.A
LINEINL  (via drill 0.35)
  Top 0.254: v260.9,72.04 260.8,72.14 260.8,75.25 259.54,76.51 238.8,76.51 238.4,76.91 238.4,77.8 237.98,78.22 231.62,78.22 v230.7,77.3
  Bottom 0.254: IC2.14 254.63,70.84 254.77,70.98 259.84,70.98 v260.9,72.04 | v230.7,77.3 227.9,77.3 226.6,78.6 226.6,83.9 224.62,85.88 C3.2
LINEINR  (via drill 0.35)
  Top 0.254: v258.4,72.04 258.4,75.5 257.8,76.1 237.9,76.1 237.4,76.6 v237.4,77.2
  Bottom 0.254: IC2.13 254.13,70.97 255.25,72.09 258.36,72.09 v258.4,72.04 | v237.4,77.2 237.4,79.59 C4.2
LINEOUTL  (via drill 0.35)
  Top 0.254: v256.5,77.82 256.06,78.26 256.06,78.34 251.2,83.2 v203.8,83.2
  Bottom 0.254: IC2.12 253.63,71.05 255.08,72.49 255.09,72.49 256.05,73.45 256.05,75.95 256.5,76.4 v256.5,77.82 | v203.8,83.2 200.32,86.68 C2.2
LINEOUTR  (via drill 0.35)
  Top 0.254: v255.4,78.07 255.4,78.37 252.91,80.87 251.38,82.4 v215.2,82.4
  Bottom 0.254: v255.4,78.07 255.4,76.7 254.91,76.21 254.04,76.21 253.44,75.61 253.44,71.57 253.13,71.26 IC2.11 | C1.2 213.66,79.16 214.35,79.85 214.35,81.55 v215.2,82.4
LIPO+  (via drill 0.8 pad 1.3, 0.85)
  Top 0.813: v274.3,21.6 271.33,21.6 270.17,22.75 266.75,22.75 v266.7,22.7 | v262.4,22.7 261.42,21.72 v261.42,9.5
  Bottom 0.254: IC4.3 IC4.4 254.68,9.89 254.9,9.89
  Bottom 0.406: 254.9,9.89 257.01,9.89 C21.1
  Bottom 0.813: U$1.P$5 U$1.P$2 274.32,21.62 v274.3,21.6 | v266.7,22.7 v262.4,22.7 255.4,15.7 229.14,15.7 J6.1 | v261.42,9.5 261.41,9.49 C21.1
MCLK
  Bottom 0.254: IC2.21 257.05,67.15 259.55,64.65 R8.1
MIC  (via drill 0.35)
  Top 0.254: v272.5,82.3 266.1,82.3 v263.7,79.9 | v262.71,72 263.7,72.99 263.7,74.31 263.67,74.33 263.67,75.25 263.7,75.28 v263.7,77.8
  Bottom 0.254: IC2.15 255.13,70.58 260.57,70.58 261.69,71.7 262.41,71.7 v262.71,72 | C12.1 272.53,82.33 v272.5,82.3 | v263.7,79.9 v263.7,77.8
MICBIAS  (via drill 0.35)
  Top 0.254: v264.9,72 265.5,72.6 278.1,72.6 278.7,73.2 v278.7,77
  Bottom 0.254: IC2.16 255.63,70.07 260.65,70.07 261.56,70.98 263.88,70.98 v264.9,72 | C11.1 277.41,77.02 277.41,77.1 | 277.41,77.1 R7.1 | v278.7,77 278.6,77.1 277.41,77.1
MOSI1  (via drill 0.35)
  Top 0.254: v164.2,73.6 164,73.8 164,93.8 v163.4,94.4 | v118,89.6 118,81.92 DISP.3
  Bottom 0.254: J3.7 229.86,72.9 164.9,72.9 v164.2,73.6 | v118,89.6 118,93.5 120,95.5 137.4,95.5 139.1,93.8 142.3,93.8 144,95.5 162.3,95.5 v163.4,94.4
N$1  (via drill 0.35)
  Top 0.254: LED4.C 265.48,76.8 v264.4,76.8
  Bottom 0.254: IC1.18 254.55,94.95 257.2,92.3 257.2,81.7 262,76.9 264.3,76.9 v264.4,76.8
N$2  (via drill 0.35)
  Top 0.254: LED1.C 273.57,76.87 v273.4,76.7
  Bottom 0.254: v273.4,76.7 266.5,83.6 266.5,88.6 264.6,90.5 260.68,90.5 260.41,90.77 260.41,93.07 257.83,95.64 IC1.1
N$3  (via drill 0.35)
  Top 0.254: LED2.C 270.47,76.87 v270.4,76.8
  Bottom 0.254: v270.4,76.8 268.9,76.8 259.7,86 259.7,92.4 256.56,95.54 IC1.20
N$4  (via drill 0.35)
  Top 0.254: LED3.C 267.47,76.87 v267.4,76.8
  Bottom 0.254: IC1.19 255.29,95.61 258.5,92.4 258.5,84.6 259.85,83.25 261.55,83.25 267.4,77.4 v267.4,76.8
N$5
  Top 0.254: SW1.A 17,84.13 SW1.SW2
N$6  (via drill 0.35)
  Top 0.254: LED5.C 260.15,77.25 v259.8,77.6
  Bottom 0.254: v259.8,77.6 257.9,79.5 254.55,79.5 248.69,85.36 248.69,91.69 250.68,93.68 IC1.17
N$7  (via drill 0.35)
  Top 0.254: LED6.C 256.77,80.27 v256.8,80.3
  Bottom 0.254: v256.8,80.3 254.53,80.3 249.3,85.53 249.3,90.9 250.81,92.41 IC1.16
N$8  (via drill 0.35)
  Top 0.254: LED7.C 256.26,83 v255.1,83
  Bottom 0.254: v255.1,83 252.6,83 249.9,85.7 249.9,90.2 250.7,91 253.39,91 IC1.15
N$9  (via drill 0.35)
  Top 0.254: LED8.C 255.13,85.97 v255.1,86
  Bottom 0.254: IC1.14 253.5,89.84 253.5,87.6 v255.1,86
N$10  (via drill 0.35)
  Top 0.254: LED9.C 256.29,89.51 255.7,90.1 v255.3,90.1
  Bottom 0.254: v255.3,90.1 IC1.13
N$11  (via drill 0.35)
  Top 0.254: LED10.C 255.9,91.58 v255.9,90.8
  Bottom 0.254: v255.9,90.8 256.6,90.1 256.6,88.15 IC1.12
N$12  (via drill 0.35)
  Top 0.254: v260.3,84 264.96,84 v267.16,86.2
  Bottom 0.254: R1.1 R2.2 268.26,87.3 v267.16,86.2 | IC1.10 259.1,85.2 v260.3,84
N$13  (via drill 0.35)
  Top 0.254: v259.6,82.1 259.6,89.8 261,91.2 266.6,91.2 v266.7,91.3
  Bottom 0.254: IC1.11 257.83,83.87 v259.6,82.1 | v266.7,91.3 266.7,92.2 267.43,92.93 275.5,92.93 275.74,92.93 276.31,93.5 JP1.2
N$14  (via drill 0.35)
  Top 0.254: v266.7,89.9 266.64,89.84 v264,89.84
  Bottom 0.254: R1.2 268.05,91.25 v266.7,89.9 | v264,89.84 263.97,89.87 IC1.8
N$15
  Top 0.254: LED12.C R4.2
N$16
  Top 0.254: LED14.C R6.2
N$17
  Top 0.254: LED13.C R5.2
N$18
  Bottom 0.254: C13.2 IC2.10
N$19
  Bottom 0.254: MIC.1 279.33,82.33 C12.2 275.71,82.28 R7.2
N$20
  Bottom 0.254: C1.1 212.95,86.95 J9.2
N$21
  Bottom 0.254: C2.1 204.75,94.4 J9.3
N$22  (via drill 1)
  other vias: 253.1,10.2
N$23  (via drill 1)
  other vias: 140.1,76.7
N$24
  Top 0.254: SW2.SW2 33,84.13 SW2.A
N$25
  Top 0.254: SW3.SW2 49,84.13 SW3.A
N$26
  Top 0.254: SW4.SW2 65.5,84.13 SW4.A
N$27
  Top 0.254: SW5.SW2 81.5,84.13 SW5.A
N$28
  Top 0.254: SW6.SW2 97.5,84.13 SW6.A
N$29
  Top 0.254: SW7.SW2 113.5,84.13 SW7.A
N$30
  Top 0.254: SW8.A 17,66.63 SW8.SW2
N$31
  Top 0.254: SW9.SW2 33,66.63 SW9.A
N$32
  Top 0.254: SW10.SW2 49,66.63 SW10.A
N$33
  Top 0.254: SW11.SW2 65.5,66.63 SW11.A
N$34
  Top 0.254: SW12.SW2 81.5,66.63 SW12.A
N$35
  Top 0.254: SW13.SW2 97.5,66.63 SW13.A
N$36
  Top 0.254: SW14.SW2 113.5,66.63 SW14.A
N$37
  Top 0.254: SW15.A 17,49.13 SW15.SW2
N$38
  Top 0.254: SW16.SW2 33,49.13 SW16.A
N$39
  Top 0.254: SW17.SW2 49,49.13 SW17.A
N$40
  Top 0.254: SW18.SW2 73.75,43.48 SW18.A
N$41
  Top 0.254: SW19.SW2 89.75,43.48 SW19.A
N$42
  Top 0.254: SW20.SW2 121.75,43.48 SW20.A
N$43
  Top 0.254: SW21.SW2 137.75,43.48 SW21.A
N$44
  Top 0.254: SW22.A 17,31.63 SW22.SW2
N$45
  Top 0.254: SW23.SW2 33,31.63 SW23.A
N$46
  Top 0.254: SW24.SW2 49,31.63 SW24.A
N$47
  Top 0.254: SW25.SW2 65.5,17.23 SW25.A
N$48
  Top 0.254: SW26.SW2 81.5,17.4 81.5,17.23 80.1,15.83 80.03,15.77 SW26.A
N$49
  Top 0.254: SW27.SW2 97.5,17.23 SW27.A
N$50
  Top 0.254: SW28.SW2 113.5,17.23 SW28.A
N$51
  Top 0.254: SW29.SW2 153.75,43.48 SW29.A
N$52
  Top 0.254: SW30.SW2 185.75,43.48 SW30.A
N$53
  Top 0.254: SW31.SW2 201.75,43.48 SW31.A
N$54
  Top 0.254: SW32.SW2 233.75,43.48 SW32.A
N$55
  Top 0.254: SW33.SW2 249.75,43.18 247.9,41.33 SW33.A
N$56
  Top 0.254: SW34.SW2 265.75,43.48 SW34.A
N$57
  Top 0.254: SW35.SW2 241.5,17.23 SW35.A
N$58
  Top 0.254: SW36.SW2 129.5,17.23 SW36.A
N$59
  Top 0.254: SW37.SW2 145.5,17.23 SW37.A
N$60
  Top 0.254: SW38.SW2 161.5,17.23 SW38.A
N$61
  Top 0.254: SW39.SW2 177.5,17.23 SW39.A
N$62
  Top 0.254: SW40.SW2 193.5,17.23 SW40.A
N$63
  Top 0.254: SW41.SW2 209.5,17.23 SW41.A
N$64
  Top 0.254: SW42.SW2 225.5,17.23 SW42.A
N$65
  Top 0.254: SW43.SW2 257.5,17.23 SW43.A
N$66  (via drill 0.35)
  Top 0.254: v273.1,15.1 271.37,15.1 SW44.A
  Bottom 0.254: SW44.SW2 273.1,23.78 v273.1,15.1
N$67
  Top 0.254: SW45.SW2 177.5,63.43 SW45.A
N$68
  Top 0.254: SW46.SW2 193.5,63.43 SW46.A
N$69
  Top 0.254: SW47.SW2 209.5,63.43 SW47.A
N$70
  Bottom 0.152: L.C 136,87.91
  Bottom 0.254: 136,87.91 R13.2
N$71
  Bottom 0.254: P.C 125.66,76.46 R12.2
N$72
  Top 0.254: R3.2 LED11.C
N$73
  Bottom 0.406: R16.1 R17.2 272.4,34.6 271.3,33.49 U3.5
N$74
  Bottom 0.406: U3.1 264.55,31.55 262.99,29.99 L2.P$2
N$75
  Bottom 0.406: U3.6 R14.2
N$76
  Bottom 0.254: PWR.C 279.5,27.33 R18.2
N$77
  Bottom 0.254: IC4.10 249.82,11.29 R19.2
N$78
  Bottom 0.254: R20.2 249.59,9.79 IC4.7
N$79
  Bottom 0.254: R20.1 246.29,1.83 CHARGE.A
N$80
  Bottom 0.254: U4.3 250.12,32.24 R23.1 R21.2
N$81
  Top 0.254: U$25.DOUT 46.38,20.38 U$26.DIN
N$82
  Top 0.254: U$26.DOUT 46.38,16.38 U$27.DIN
N$83
  Top 0.254: U$27.DOUT 46.38,12.38 U$36.DIN
N$84
  Top 0.254: U$36.DOUT 46.38,8.38 U$41.DIN
N$85
  Top 0.254: U$41.DOUT 48.33,5.43 47.69,4.8 11.26,4.8 10.62,5.43 U$42.DIN
N$86
  Top 0.254: U$43.DIN 8.68,8.68 U$42.DOUT
N$87
  Top 0.254: U$44.DIN 8.68,12.68 U$43.DOUT
N$88
  Top 0.254: U$45.DIN 8.68,16.68 U$44.DOUT
N$89
  Top 0.254: U$46.DIN 8.68,20.68 U$45.DOUT
N$90
  Bottom 0.254: BRD_ANT.1 157.31,49.1 158.71,50.5 ANT.2
N$91  (via drill 0.35)
  Top 0.254: v150.3,37.7 150.3,12.9 v149.8,12.4
  Bottom 0.254: BRD_ANT.2 150.3,40.31 v150.3,37.7 | v149.8,12.4 52.3,12.4 arc90 51.4,11.5 arc90 52.4,10.5 243.3,10.5 arc-90 244.3,9.5 | 244.3,9.5 244.3,9.4 arc-90 243.5,8.6 243.4,8.6 | 243.4,8.6 52.2,8.6 arc90 51.4,7.8 arc90 52.4,6.8 243.5,6.8 arc-90 244.4,5.9 244.4,5.8 arc-90 243.6,5 199.7,5 | 244.3,9.5 arc-90 243.4,8.6
N$92
  Bottom 0.254: J5.1 129.88,68.78 132.1,71 R26.2
NAN
  cutout Top: 51.8,13.1 243,13.1 244.4,11.7 244.4,0 50.9,0 50.9,12.2
NEOPIXEL  (via drill 0.35)
  Top 0.254: v56.7,56.7 56.7,33.96 U$25.DIN | J2.15 252.08,55.78 251.65,55.35 227.85,55.35 225.7,57.5 v224.9,57.5
  Bottom 0.254: v56.7,56.7 57.1,57.1 142,57.1 144.9,54.2 210.5,54.2 213.8,57.5 v224.9,57.5
PIN6
  Bottom 0.254: J3.17 257.16,78.24 256.5,78.9 253.2,78.9 252.6,78.3 243.86,78.3 240.6,75.04 240.6,71.91 U1.1 237.64,69.04 R11.2
PIN7
  Top 0.254: JP3.1 254.59,74.77 J3.16
PIN8
  Top 0.254: JP4.1 252.09,74.78 J3.15
PIN11  (via drill 0.35)
  Top 0.254: v233.4,65.1 234.76,65.1 J3.12
  Bottom 0.254: U1.5 233.31,65.19 v233.4,65.1
PIN12
  Bottom 0.254: U1.2 239.28,67.72 239.3,67.7 241.92,70.32 J3.11
PIN13
  Bottom 0.254: U1.6 232.94,66.45 233,66.4 233.9,66.4 238.4,61.9 240.8,61.9 241.92,60.78 J2.11
PIN20  (via drill 0.35)
  Top 0.254: v259.6,63.5 259.6,59.65 J2.18
  Bottom 0.254: IC2.23 256.95,66.15 v259.6,63.5
PIN21
  Bottom 0.254: J2.19 256.33,65.46 IC2.24
PIN23
  Bottom 0.254: J2.21 265.67,61.2 263.3,61.2 R8.2
RADIO_GPIO1  (via drill 0.35)
  Top 0.254: J2.3 225.55,55.6 v226.2,55.6 | v222.9,52.29 219.41,48.8 v219.2,48.8
  Bottom 0.254: v226.2,55.6 v222.9,52.3 v222.9,52.29 | v219.2,48.8 179.1,48.8 178,47.7 174.56,47.7 J8.2
RADIO_GPIO2  (via drill 0.35)
  Top 0.254: J2.2 223.01,55.6 v224.1,55.6 | v220.8,52.29 v218.21,49.7 v218.2,49.7
  Bottom 0.254: v224.1,55.6 v220.8,52.3 v220.8,52.29 | v218.2,49.7 217.76,49.26 179.14,49.26 178.1,50.3 174.5,50.3 J8.1
RADIO_LOUT  (via drill 0.35)
  Top 0.254: v233.1,77.2 233.1,71.4 222.3,71.4 216.7,65.8 v213.4,65.8 | v208.8,65.9 208.8,68.9 204,73.7 174.7,73.7 169,68 v169,41.1 | v169,37.1 v169,34.5
  Bottom 0.254: v233.1,77.2 233.1,77.7 232.8,78 230.5,78 230,78.5 230,93.9 J4.3 228.85,94.2 C3.1 | v213.4,65.8 208.9,65.8 v208.8,65.9 | v169,41.1 v169,37.1 | v169,34.5 169,28.4 169.7,27.7 174.24,27.7 J8.10
RADIO_ROUT  (via drill 0.35)
  Top 0.254: v235.7,77.2 235.7,73.4 233.2,70.9 222.7,70.9 216.6,64.8 v213.4,64.8 | v208.04,64.8 207.94,64.9 207.94,68.66 203.39,73.21 174.79,73.21 169.7,68.12 169.7,41.5 v170.1,41.1 | v170.1,37.1 v170.1,34.5
  Bottom 0.254: v235.7,77.2 235.7,79.67 C4.1 237.35,86.61 J4.2 | v208.04,64.8 v213.4,64.8 | v170.1,41.1 v170.1,37.1 | v170.1,34.5 170.1,30.6 170.52,30.18 J8.9
ROW1
  Bottom 0.254: SW1.1 SW2.1 SW3.1 SW4.1 SW5.1 SW6.1 SW7.1 114.22,92.28 118.6,87.9 119.5,87.9 126.55,80.85 126.55,79.95 129.02,77.48 U2.44
ROW2  (via drill 0.35)
  Top 0.254: v127.3,80.3 120.8,86.8 v119.6,86.8
  Bottom 0.254: SW8.1 SW9.1 | SW8.1 SW10.1 | SW8.1 SW11.1 | SW8.1 SW12.1 | SW8.1 SW13.1 | SW8.1 SW14.1 118.62,86.8 v119.6,86.8 | v127.3,80.3 129.62,77.98 U2.45
ROW3  (via drill 0.35)
  Top 0.254: v130.8,55.7 v130.8,80.4
  Bottom 0.254: SW15.1 SW16.1 SW17.1 44.22,57.28 49.87,51.63 SW18.1 SW19.1 SW20.1 SW21.1 130.85,55.65 v130.8,55.7 | v130.8,80.4 132.72,78.48 U2.46
ROW4  (via drill 0.35)
  Top 0.254: v101.4,50 v101.4,53.7 | v129.5,55.7 129.5,80.6 v130.1,81.2
  Bottom 0.254: SW22.1 SW23.1 SW24.1 44.2,39.78 SW25.1 SW26.1 SW27.1 SW28.1 101.4,30.58 v101.4,50 | v101.4,53.7 102.6,54.9 128.7,54.9 v129.5,55.7 | v130.1,81.2 130.24,81.06 131.07,81.06 133.15,78.98 U2.47
ROW5  (via drill 0.35)
  Top 0.254: v234.5,39.3 234.5,36.4 v234.6,36.3 | SW29.1 143.38,55.1 133,55.1 132.5,55.6 132.5,81.1 v132.4,81.1
  Bottom 0.254: U2.48 135.94,79.5 134,79.5 v132.4,81.1 | SW34.1 SW33.1 | SW33.1 242.85,49.53 234.5,41.18 v234.5,39.3 | v234.6,36.3 SW35.1 | SW29.1 147.25,52.03 155.6,52.03 156.1,51.53 178.75,51.53 SW30.1 SW31.1 SW32.1 SW33.1
ROW6  (via drill 0.35)
  Top 0.254: v103.1,50 v103.1,55.7 | v131,81.9 130.96,81.86 129.83,81.86 128.1,80.13 v128.1,55.7
  Bottom 0.254: SW42.1 SW41.1 SW40.1 SW39.1 SW38.1 SW37.1 SW36.1 109.52,25.38 103.1,31.8 v103.1,50 | v128.1,55.7 v103.1,55.7 | v131,81.9 132.69,81.9 133.19,81.39 136.89,81.39 U2.1
ROW7  (via drill 0.35)
  Top 0.254: v134,82.1 133.2,81.3 133.2,56 133.6,55.6 166.82,55.6 168.51,57.29 168.51,69.49 SW45.1 | SW47.1 197,65.98 197,59.9 201.4,59.9 v218.6,42.7 | v218.6,39.1 v218.6,36.1
  Bottom 0.254: SW47.1 SW46.1 SW45.1 | SW44.1 SW43.1 248.02,22.8 231.9,22.8 v218.6,36.1 | v134,82.1 137.6,82.1 137.88,81.82 U2.2 | v218.6,42.7 v218.6,39.1
RST1
  Bottom 0.254: DISP.7 124.39,65.38 124.39,58.59 146.8,58.59 149.57,55.81 209.41,55.81 214.7,61.1 224.8,61.1 225.4,60.5 225.4,58.6 226.3,57.7 236.3,57.7 236.84,58.24 J2.9
RX/DOUT  (via drill 0.35)
  Top 0.254: v256.39,61.83 256.28,61.83 255.62,61.17 255.08,61.17 254.63,61.61 253.5,61.61 253.49,61.62 252.7,61.62 249.29,65.03 249.29,68.91 v248.8,69.4 | JP4.2 250.43,71.67 250.2,71.9 249.53,71.9 v249,71.9
  Bottom 0.254: IC2.25 255.63,62.59 v256.39,61.83 | v249,71.9 248.8,71.7 v248.8,69.4
RXD
  Bottom 0.254: U2.35 137.88,71.18 135.8,69.1 134.3,69.1 133.6,68.4 133.6,63.06 J5.4
SCK1  (via drill 0.35)
  Top 0.254: v165.4,73.7 164.8,74.3 v164.8,94.36 | v117.17,90.36 117.17,80.22 DISP.4
  Bottom 0.254: J3.6 227.82,73.4 165.7,73.4 v165.4,73.7 | v164.8,94.36 163.1,96.06 143.7,96.06 141.95,94.31 139.35,94.31 137.6,96.06 119.66,96.06 117.17,93.56 v117.17,90.36
SCL  (via drill 0.35)
  Top 0.254: v160.8,80.8 v162.4,79.2 v162.4,79.19 | v166.6,79.19 166.6,76 167.09,75.51 208.74,75.51 212.51,71.74 212.51,64.49 215.8,61.21 253.8,61.21 254.35,60.66 256.05,60.66 J2.17 257.2,59.51 R10.2 v259.09,56.59 v259.1,56.6 | v243.76,48.64 240.54,48.64 v240.5,48.6 | v185.9,37 v184.3,38.6
  Bottom 0.254: IC2.29 253.63,60.63 253.4,60.4 253.4,58.5 253.5,58.4 256,58.4 J2.17 | U2.13 145.62,80.8 v160.8,80.8 | v162.4,79.19 v166.6,79.19 | v259.1,56.6 260.6,55.1 260.6,51.2 259.3,49.9 255.9,49.9 254.6,51.2 252.6,51.2 250.04,48.64 v243.76,48.64 | v240.5,48.6 240,48.1 235.99,48.1 235.4,48.69 221.79,48.69 210.1,37 v185.9,37 | v184.3,38.6 182.56,40.34 J8.5
SDA  (via drill 0.35)
  Top 0.254: R9.2 254.5,59.44 J2.16 253.37,60.8 238,60.8 | 238,60.8 215.5,60.8 212.11,64.19 212.11,71.57 208.57,75.1 166.3,75.1 165.7,75.7 165.7,79.8 v165.5,80 | v163.1,80 162.63,80 160.82,81.81 v160.8,81.81 | v237.2,49.2 v237.2,52.7 | v237.2,56.1 238,56.9 238,60.8
  Bottom 0.254: IC2.27 254.63,59.57 J2.16 | v163.1,80 v165.5,80 | U2.12 142.88,81.58 143.11,81.81 v160.8,81.81 | v237.2,49.2 237.1,49.1 221.4,49.1 215,42.7 214.9,42.6 210.1,37.8 J8.6 | v237.2,52.7 v237.2,56.1
T3.3V  (via drill 0.35)
  Top 0.254: v263.9,92.4 264.4,92.4 266.21,94.21 POT1.V2 | 257.15,54.94 R9.1 212.66,54.94 211.7,55.9 211.7,71.4 208.41,74.69 168.09,74.69 166.3,72.9 v162.1,72.9 | 257.15,54.94 R10.1 | J2.22 269.86,55.76 269.04,54.94 267.3,54.94 | 267.3,54.94 257.15,54.94 | 137.39,76.5 v134.3,76.5 | v152,72.9 152,79 v145.8,79 | C17.1 138.18,78.98 137.39,78.19 137.39,76.5 | 145,78.98 145,74.3 144.79,74.09 C16.1 142.1,73.29 v142.1,71 142.1,57.1 v141.3,56.3 | v104,37.5 v100.2,37.5 | v52.88,32.62 v51.59,31.32 | v41.9,14.1 36.43,14.1 U$2.POWER | 267.3,54.94 267.3,44.7 268,44 274.2,44 276,45.8 276,51 280.3,55.3 280.3,78.7 277.3,81.7 277.3,94.3 276.7,94.9 v274,94.9 | C17.1 145,78.98 | v145.8,79 142.73,79 C17.1 | 137.39,76.5 C15.1 | 145,78.98 145.02,79 v145.8,79
  Bottom 0.254: v263.9,92.4 263.5,92.4 IC1.6 | v142.1,71 141.38,71.72 U2.28 | v145.8,79 144.33,79 U2.14 | U2.42 135.94,76.5 v134.3,76.5 130.55,76.5 P.A 130.51,72.31 128.7,70.5 128.7,63.02 129.86,61.86 J5.2 | v162.1,72.9 v152,72.9 | v141.3,56.3 141.3,38.8 140.1,37.6 104.1,37.6 v104,37.5 104,36.2 104.94,35.26 J8.7 | v100.2,37.5 57.77,37.5 v52.88,32.62 | v51.59,31.32 42.2,21.93 42.2,14.4 v41.9,14.1 | POT1.V2 267.32,96 272.9,96 v274,94.9
TRIG  (via drill 0.35)
  Top 0.254: v143.2,71 v143.2,57.84
  Bottom 0.254: v143.2,71 143.2,72.23 U2.25 | J2.1 214.52,59.55 209.97,55.01 149.07,55.01 146.23,57.84 v143.2,57.84
TX/DIN  (via drill 0.35)
  Top 0.254: v255.35,61.83 255.15,62.03 252.87,62.03 249.7,65.2 249.7,69.32 v249.8,69.42 | v249.8,71.24 250.05,70.99 254.1,70.99 254.18,71.08 254.18,71.6 254.46,71.87 JP3.2
  Bottom 0.254: IC2.26 255.13,62.08 v255.35,61.83 | v249.8,69.42 v249.8,71.24
TXD
  Bottom 0.254: U2.34 138.38,71 J5.5
UPDI
  Bottom 0.254: U2.41 134.78,75.98 134.2,75.4 R26.1
VDDA  (via drill 0.35)
  Top 0.254: C5.2 243.57,66.82 C6.2 246.01,66.86 246.01,67.6 L1.2 246.64,67.65 v248.16,67.65
  Bottom 0.254: IC2.5 v248.16,67.65
VDDD  (via drill 0.35)
  Top 0.254: v252.97,63.14 254.21,63.14 C7.2 255.27,64.02 256.32,64.02 256.38,64.08 U5.2
  Bottom 0.254: IC2.30 253.13,63.3 v252.97,63.14
VOL  (via drill 0.35)
  Top 0.254: v263.94,93.7 263.94,95.34 264.7,96.1 267.49,96.1 POT1.ADJ 271,92.59 v271,91.3 | v267.4,93.7 268.8,92.3 268.8,86.4 v265.5,83.1 | v257.9,77.16 v254.6,77.16
  Bottom 0.254: IC1.5 v263.94,93.7 v267.4,93.7 | v271,91.3 271.03,91.27 C14.2 | J2.13 247,72.7 248.1,73.8 248.1,75.25 248.1,75.9 249.36,77.16 v254.6,77.16 | v265.5,83.1 265.6,83.1 271.65,77.05 271.65,76.35 271.3,76 258.7,76 257.9,76.8 v257.9,77.16
VUSB
  Bottom 0.254: IC4.1 IC4.2 | 262.5,11.5 262.5,4.5 259.81,1.81 CHARGE.C | R24.1 268.05,8.15 267.8,8.4
  Bottom 0.508: J7.1 269.85,10.88 Q2.2 | Q2.7 263.82,11.5 262.5,11.5 C22.1 254.79,11.5 IC4.1
  Bottom 0.61: Q2.2 267.2,10.95 | 267.2,10.95 Q2.7 Q2.8 | Q2.4 267.8,8.4 267.2,9 267.2,10.95

## Text on the board
tNames: JOYSTICK
bNames: MIC | GND | UPDI | TX | 3.3V | RX | GND | LINE OUT | L | R | V2.1 PCB | Prajwal Tumkur Mahesh | November 2020